# EasyEDA Pro project rpi5torpi4.epro

# Schematic Schematic1
Board Name: Board1; Create Date: 2024-10-25; Page Name: P1; Project Name: RPI5_CDSI_2_RPI4_DSI; Schematic Name: Schematic1; Update Date: 2024-10-25; Company: 嘉立创EDA; Page Size: A4; Version: V1.0
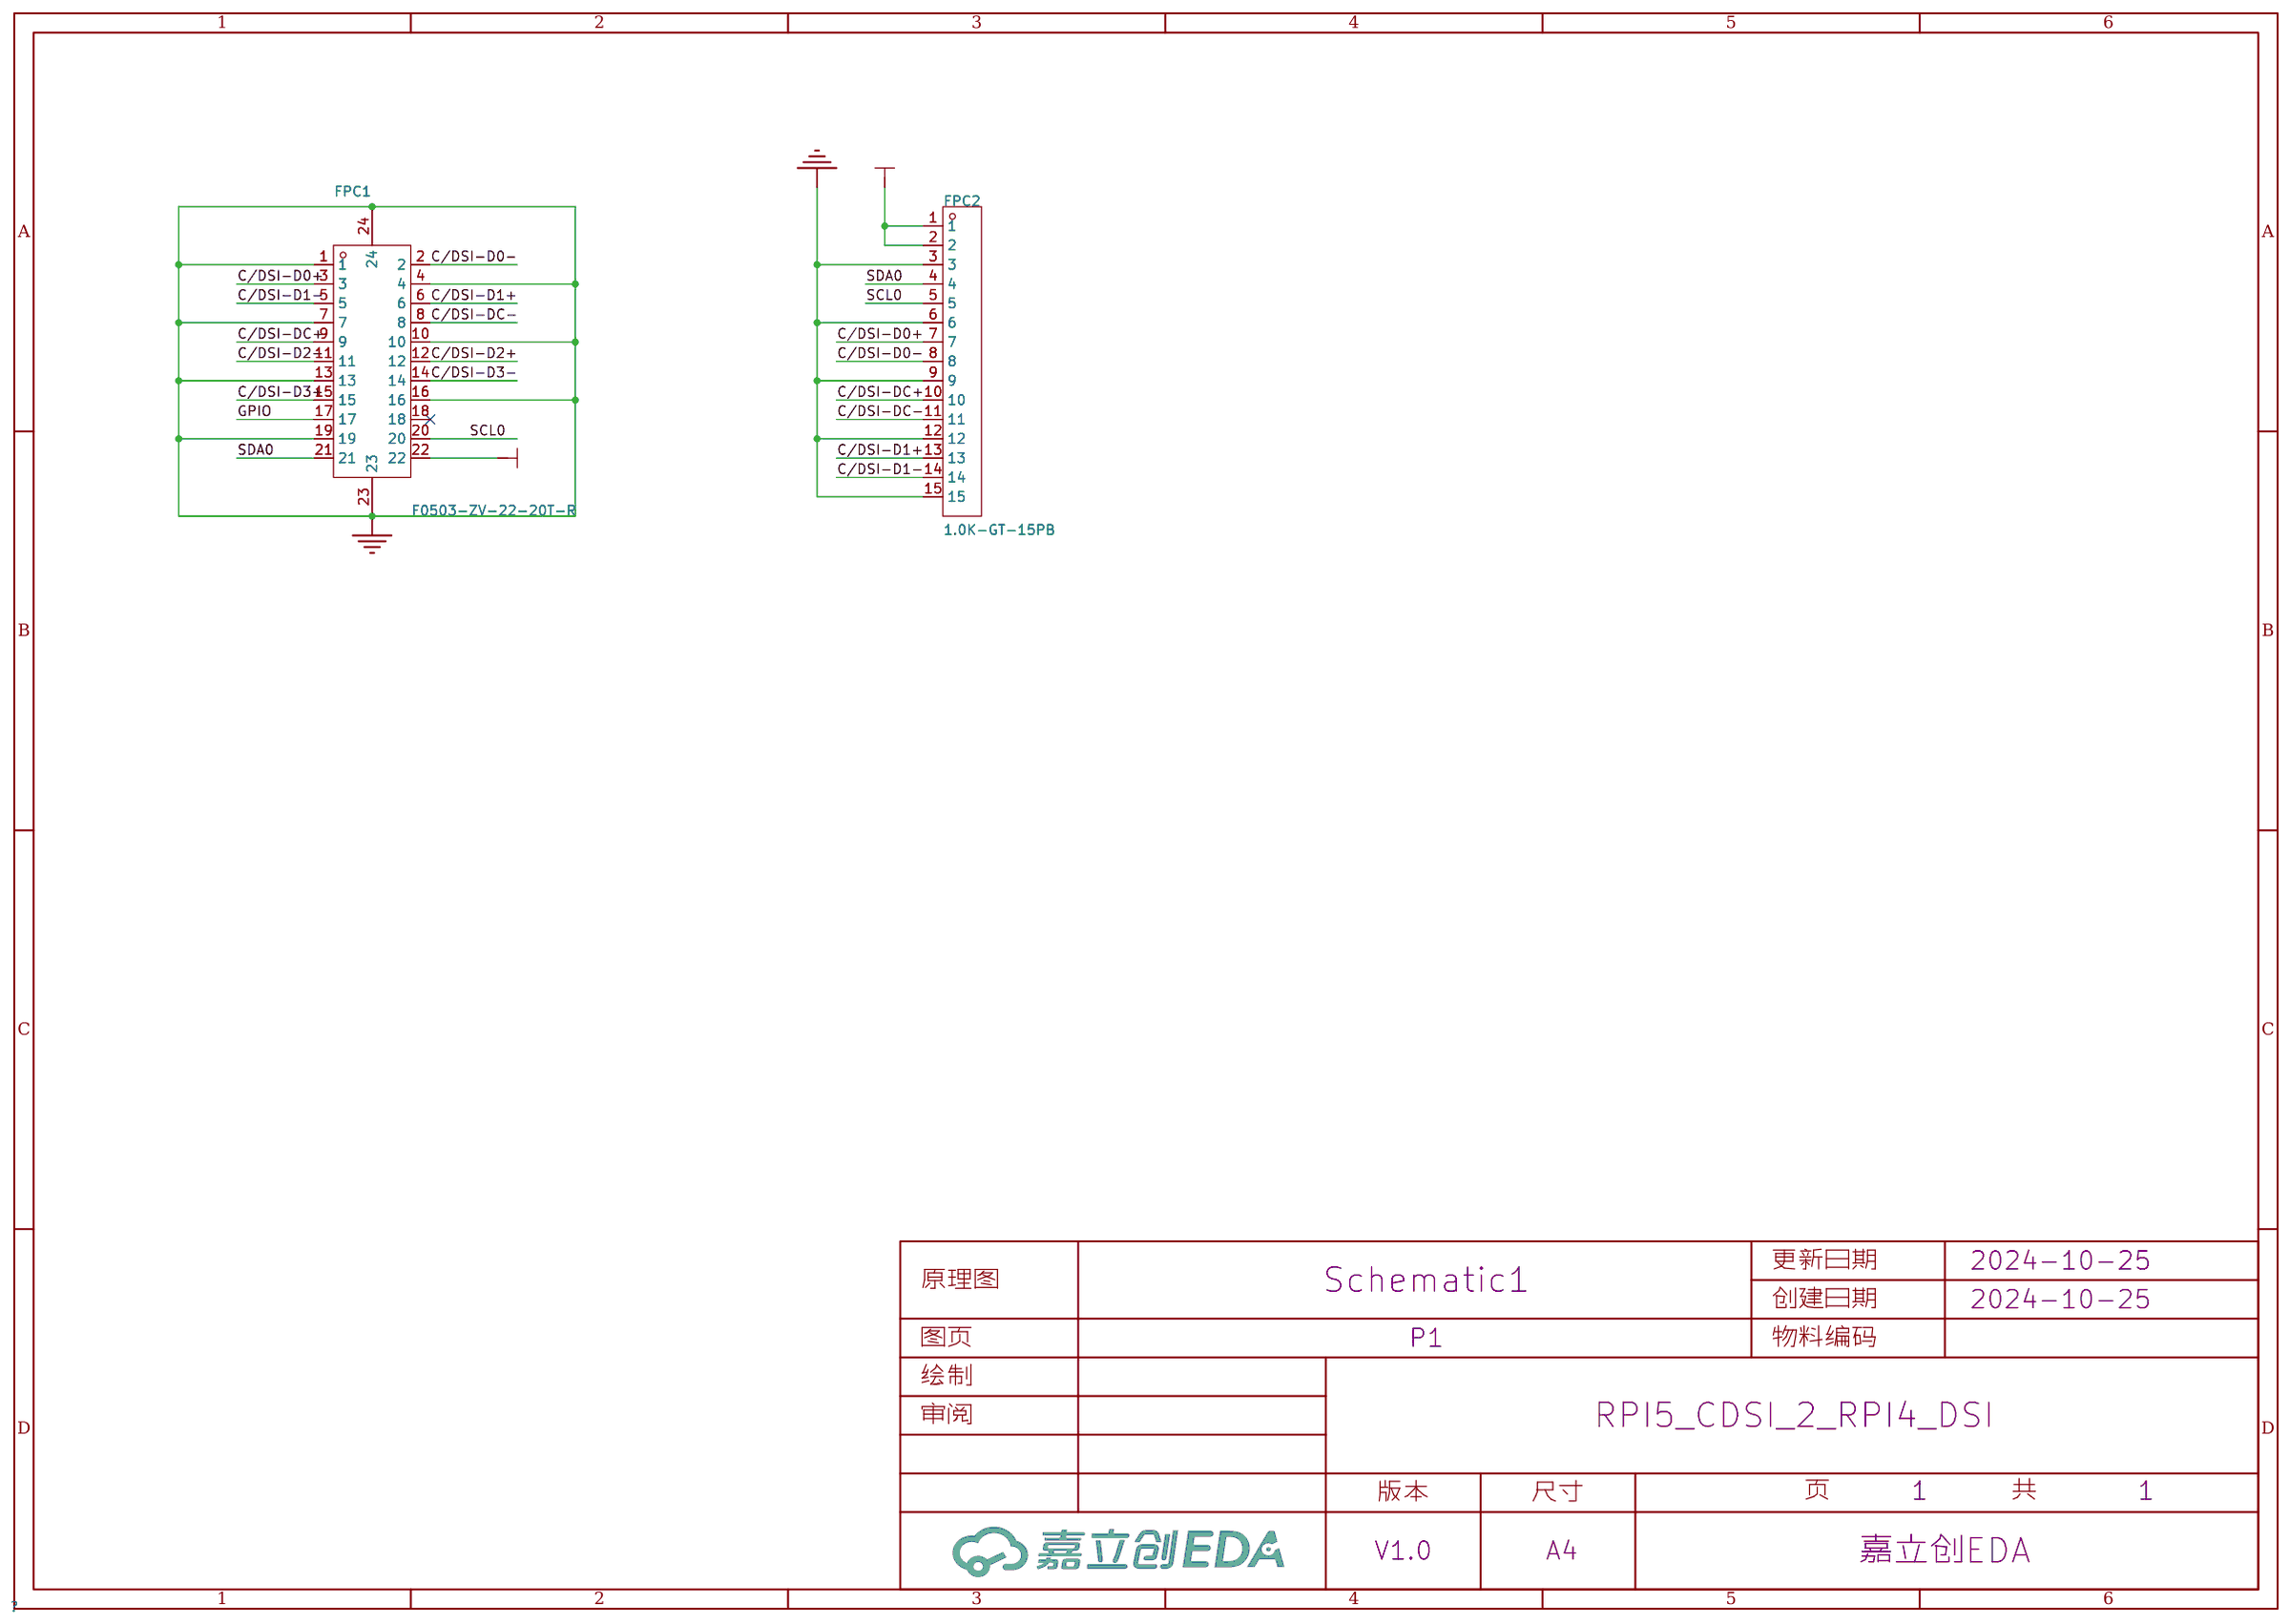
[diagram p0: schematic sheet]

## Parts
FPC1  F0503-ZV-22-20T-R  [FPC-SMD_F0503-ZV-22-20T-R]
FPC2  1.0K-GT-15PB  [FPC-SMD_15P-P1.00_HDGC_1.0K-GT-15PB]

## Library data of the parts
FPC1 = F0503-ZV-22-20T-R: 锁定特性:抽屉式;触点类型:单侧触点/垂直;触点数量:22P;间距:0.5mm;安装类型:立贴;; LCSC Part Name: 间距:0.5mm P数:22P 抽屉式 单侧触点/垂直; Supplier Part: C481245; Manufacturer: XFCN(兴飞); Supplier Footprint: SMD,P=0.5mm; JLCPCB Part Class: 扩展库; Datasheet: https://atta.szlcsc.com/upload/public/pdf/source/20200107/C481246_A545DBDF4B5EF127D16C10A1E19E69F2.pdf; Supplier: LCSC; Locking Feature: 抽屉式; Contact Type: 单侧触点/垂直; Number of Contacts: 22P; Pitch: 0.5mm; Mounting Type: 立贴; FFC, FCB Thickness: 0.3mm; Height Above Board: 4.6mm
FPC2 = 1.0K-GT-15PB: 锁定特性:抽屉式;触点类型:单侧触点/垂直;触点数量:15P;间距:1mm;安装类型:立贴;工作温度范围:-20℃~+85℃;; LCSC Part Name: 抽屉式 单侧触点/垂直 P数:15P 间距:1mm; Supplier Part: C2915527; Manufacturer: HDGC(华德共创); Supplier Footprint: SMD,P=1mm; JLCPCB Part Class: 扩展库; Datasheet: https://atta.szlcsc.com/upload/public/pdf/source/20211109/B713BDE52A9F4A725B84AF7900C38EEB.pdf; Supplier: LCSC; Locking Feature: 抽屉式; Contact Type: 单侧触点/垂直; Number of Contacts: 15P; Pitch: 1mm; Mounting Type: 立贴; FFC, FCB Thickness: 0.3mm; Height Above Board: 5.4mm; Operating Temperature Range: -20℃~+85℃

## Nets
3V3: FPC1.22 FPC2.1 FPC2.2
GND: FPC1.1 FPC1.4 FPC1.7 FPC1.10 FPC1.13 FPC1.16 FPC1.19 FPC1.23 FPC1.24 FPC2.3 FPC2.6 FPC2.9 FPC2.12 FPC2.15
C/DSI-D0+: FPC1.3 FPC2.7
C/DSI-D0-: FPC1.2 FPC2.8
C/DSI-D1+: FPC1.6 FPC2.13
C/DSI-D1-: FPC1.5 FPC2.14
C/DSI-D2+: FPC1.12
C/DSI-D2-: FPC1.11
C/DSI-D3+: FPC1.15
C/DSI-D3-: FPC1.14
C/DSI-DC+: FPC1.9 FPC2.10
C/DSI-DC-: FPC1.8 FPC2.11
GPIO: FPC1.17
SCL0: FPC1.20 FPC2.5
SDA0: FPC1.21 FPC2.4

Not connected (* = marked no-connect by the designer): FPC1 18*

# Board PCB1
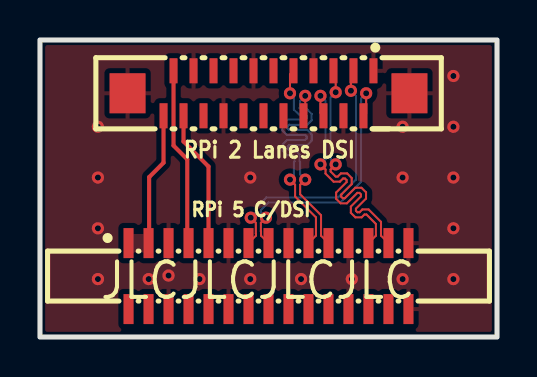
[diagram p1: board, top side]
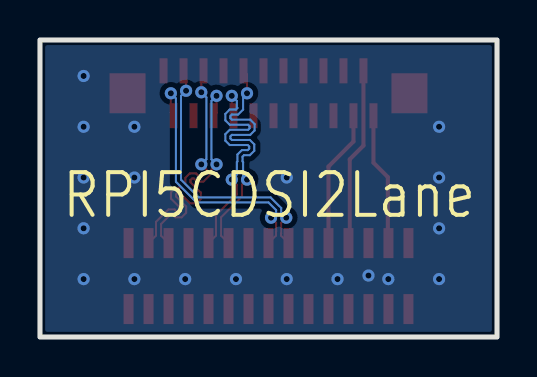
[diagram p2: board, bottom side, seen from below]

Outline 22.86 x 14.86 mm; copper layers: Top Layer, Bottom Layer. Coordinates in mm from the lower left corner of the outline.
Outline path: rectangle 0,14.86 22.86,0
Stack: Top Layer 0.035mm / Dielectric1 1.51mm FR4 er 4.5 / Bottom Layer 0.035mm

## Design rules (mm)
net C/DSI-DC+: C/DSI-DC
net C/DSI-DC-: C/DSI-DC
net C/DSI-D1+: C/DSI-D1
net C/DSI-D1-: C/DSI-D1
net C/DSI-D0+: C/DSI-D0
net C/DSI-D0-: C/DSI-D0
template: 自定义配置
spacing copperThickness1oz (default): track to track 0.102, other pairs 0.102 to 0.3
spacing copperThickness2oz: track to track 0.203, other pairs 0.152 to 0.3
track width copperThickness1oz (default): min 0.102, default 0.203, max 2.54
track width copperThickness2oz: min 0.203, default 0.254, max 2.54
differential pair differentialPair (default): width min 0.102, default 0.254, max 2.54; gap min 0.152, default 0.152
via viaSize (default): diameter min 0.5, default 0.61, max 10; hole min 0.3, default 0.305, max 6.299

## Placement (name value [footprint] x y rotation side)
FPC1  F0503-ZV-22-20T-R  [FPC-SMD_F0503-ZV-22-20T-R]  11.43 12.19 180 top
RPi 5 C/DSI  1.0K-GT-15PB  [FPC-SMD_15P-P1.00_HDGC_1.0K-GT-15PB]  11.43 3.05 0 top

## Footprints (pads in the part's own frame, mm; a bottom-side part is the same pattern mirrored in y, then rotated)
FPC-SMD_15P-P1.00_HDGC_1.0K-GT-15PB
  rect 0.5x1.5 smd: 1(-7,1.65) 1(-7,-1.65) 2(-6,1.65) 2(-6,-1.65) 3(-5,1.65) 3(-5,-1.65) 4(-4,1.65) 4(-4,-1.65) 5(-3,1.65) 5(-3,-1.65) 6(-2,1.65) 6(-2,-1.65) 7(-1,1.65) 7(-1,-1.65) 8(0,1.65) 8(0,-1.65) 9(1,1.65) 9(1,-1.65) 10(2,1.65) 10(2,-1.65) 11(3,1.65) 11(3,-1.65) 12(4,1.65) 12(4,-1.65) 13(5,1.65) 13(5,-1.65) 14(6,1.65) 14(6,-1.65) 15(7,1.65) 15(7,-1.65)
FPC-SMD_F0503-ZV-22-20T-R
  rect 0.4x1.25 smd: 1(-5.25,-1.125) 2(-4.75,1.125) 3(-4.25,-1.125) 4(-3.75,1.125) 5(-3.25,-1.125) 6(-2.75,1.125) 7(-2.25,-1.125) 8(-1.75,1.125) 9(-1.25,-1.125) 10(-0.75,1.125) 11(-0.25,-1.125) 12(0.25,1.125) 13(0.75,-1.125) 14(1.25,1.125) 15(1.75,-1.125) 16(2.25,1.125) 17(2.75,-1.125) 18(3.25,1.125) 19(3.75,-1.125) 20(4.25,1.125) 21(4.75,-1.125) 22(5.25,1.125)
  rect 1.8x2 smd: 23(7.05,0) 24(-7.05,0)

## Nets
3V3: FPC1.22 RPi 5 C/DSI.1 RPi 5 C/DSI.2
GND: FPC1.1 FPC1.4 FPC1.7 FPC1.10 FPC1.13 FPC1.16 FPC1.19 FPC1.23 FPC1.24 RPi 5 C/DSI.3 RPi 5 C/DSI.6 RPi 5 C/DSI.9 RPi 5 C/DSI.12 RPi 5 C/DSI.15
C/DSI-D0+: FPC1.3 RPi 5 C/DSI.7
C/DSI-D0-: FPC1.2 RPi 5 C/DSI.8
C/DSI-D1+: FPC1.6 RPi 5 C/DSI.13
C/DSI-D1-: FPC1.5 RPi 5 C/DSI.14
C/DSI-D2+: FPC1.12
C/DSI-D2-: FPC1.11
C/DSI-D3+: FPC1.15
C/DSI-D3-: FPC1.14
C/DSI-DC+: FPC1.9 RPi 5 C/DSI.10
C/DSI-DC-: FPC1.8 RPi 5 C/DSI.11
GPIO: FPC1.17
SCL0: FPC1.20 RPi 5 C/DSI.5
SDA0: FPC1.21 RPi 5 C/DSI.4

Pads without a net: FPC1 18

## Via types
v1: diameter 0.61, hole 0.305, Top Layer to Bottom Layer, 31 vias

## Routing (per net, layer and track width the routed paths; a pad name or vN(x,y) marks a point on that pad's centre or on a via; arc(x,y) is an arc through that point)
3V3: length 6.7
  Top Layer w0.203: RPi 5 C/DSI.2 5.46,4.73 5.46,8 6.18,8.72 FPC1.22
GND:
  vias: v1(2.9,10.52) v1(2.9,7.98) v1(2.9,5.44) v1(2.9,2.9) v1(5.44,2.9) v1(6.43,3.08) v1(7.98,2.9) v1(10.52,7.98) v1(10.52,2.9) v1(13.06,2.9) v1(15.6,2.9) v1(18.14,10.52) v1(18.14,7.98) v1(18.14,2.9) v1(20.68,13.06) v1(20.68,10.52) v1(20.68,7.98) v1(20.68,5.44) v1(20.68,2.9)
C/DSI-D0+: length 13.3
  Top Layer w0.102: v1(15.55,12.32) 15.55,13.19 FPC1.3 ; RPi 5 C/DSI.7 10.8,5.07 10.8,5.17 10.79,5.18 10.79,5.71 v1(10.54,5.97)
  Bottom Layer w0.102: v1(15.55,12.32) 15.81,12.06 15.81,7.87 14.92,6.98 11.32,6.98 10.79,6.45 10.79,6.22 v1(10.54,5.97)
C/DSI-D0-: length 13.3
  Top Layer w0.102: RPi 5 C/DSI.8 11.06,5.07 11.06,5.28 11.05,5.29 11.05,5.71 v1(11.3,5.97) ; v1(16.31,12.19) 16.31,11.2 FPC1.2
  Bottom Layer w0.102: v1(16.31,12.19) 16.06,11.94 16.06,7.77 15.02,6.73 11.43,6.73 11.05,6.35 11.05,6.22 v1(11.3,5.97)
C/DSI-D1+: length 13.2
  Top Layer w0.102: v1(14.03,12.06) 14.03,11.22 FPC1.6 ; v1(14.03,8.64) 14.28,8.38 14.28,8.18 14.69,7.77 15,7.77 15.16,7.93 15.26,7.93 15.34,7.85 15.34,7.75 14.81,7.23 14.81,6.91 15.04,6.69 15.35,6.69 15.88,7.21 15.98,7.21 16.06,7.13 16.06,7.03 15.55,6.53 15.55,6.21 15.78,5.99 16.09,5.99 16.23,6.13 16.33,6.13 16.8,5.66 16.8,5.07 RPi 5 C/DSI.13
  Bottom Layer w0.102: v1(14.03,8.64) 14.28,8.89 14.28,11.81 v1(14.03,12.06)
C/DSI-D1-: length 13.4
  Top Layer w0.102: v1(14.79,8.64) 14.54,8.38 14.54,8.28 14.79,8.03 14.89,8.03 15.05,8.18 15.36,8.18 15.59,7.96 15.59,7.65 15.07,7.12 15.07,7.02 15.15,6.94 15.25,6.94 15.77,7.47 16.08,7.47 16.31,7.24 16.31,6.93 15.8,6.42 15.8,6.32 15.88,6.24 15.98,6.24 16.12,6.38 16.44,6.38 17.06,5.76 17.06,5.07 RPi 5 C/DSI.14 ; v1(14.79,12.24) 14.79,13.21 FPC1.5
  Bottom Layer w0.102: v1(14.79,8.64) 14.54,8.89 14.54,11.99 v1(14.79,12.24)
C/DSI-DC+: length 13.5
  Top Layer w0.102: RPi 5 C/DSI.10 13.8,5.07 13.8,5.99 12.76,7.03 12.76,7.62 v1(12.5,7.87) ; FPC1.9 12.5,13.14 v1(12.5,12.19)
  Bottom Layer w0.102: v1(12.5,12.19) 12.7,12 12.7,11.38 12.95,11.13 13.26,11.13 13.34,11.06 13.34,10.95 13.26,10.87 12.34,10.87 12.12,10.65 12.12,10.33 12.34,10.11 13.26,10.11 13.34,10.04 13.34,9.93 13.26,9.86 12.36,9.86 12.14,9.64 12.14,9.32 12.36,9.1 12.66,9.1 12.73,9.02 12.73,8.78 12.7,8.75 12.7,8.07 v1(12.5,7.87)
C/DSI-DC-: length 13.3
  Top Layer w0.102: v1(13.27,7.87) 13.01,7.62 13.01,7.14 14.06,6.09 14.06,5.07 RPi 5 C/DSI.11 ; FPC1.8 13.18,11.15 13.27,11.23 v1(13.27,12.06)
  Bottom Layer w0.102: v1(13.27,12.06) 13.01,11.81 13.01,11.48 12.98,11.45 13.06,11.38 13.37,11.38 13.59,11.16 13.59,10.84 13.37,10.62 12.45,10.62 12.38,10.55 12.38,10.44 12.45,10.37 13.37,10.37 13.59,10.15 13.59,9.82 13.37,9.6 12.47,9.6 12.39,9.53 12.39,9.42 12.47,9.35 12.76,9.35 12.98,9.13 12.98,8.78 13.01,8.75 13.01,8.13 v1(13.27,7.87)
SCL0: length 6.9
  Top Layer w0.203: RPi 5 C/DSI.5 8.43,8.53 7.18,9.78 FPC1.20
SDA0: length 8.9
  Top Layer w0.203: RPi 5 C/DSI.4 7.37,4.76 7.37,8.89 6.68,9.58 FPC1.21

## Copper pours and planes (outline as drawn; the poured copper is in the pictures)
GND on Top Layer: -0.76,15.62 23.11,15.62 23.11,-0.63 -0.76,-0.63
GND on Bottom Layer: -1.91,16.89 24.51,16.89 24.51,-1.65 -1.91,-1.65

Small or netless copper shapes (teardrops, artwork), in the pictures only: 1 on Top Layer

## Text on the board
Bottom Silkscreen Layer: RPI5CDSI2Lane
Top Silkscreen Layer: RPi 2 Lanes DSI | JLCJLCJLCJLC
